# Altium schematic sheet supply.SchDoc
size A4
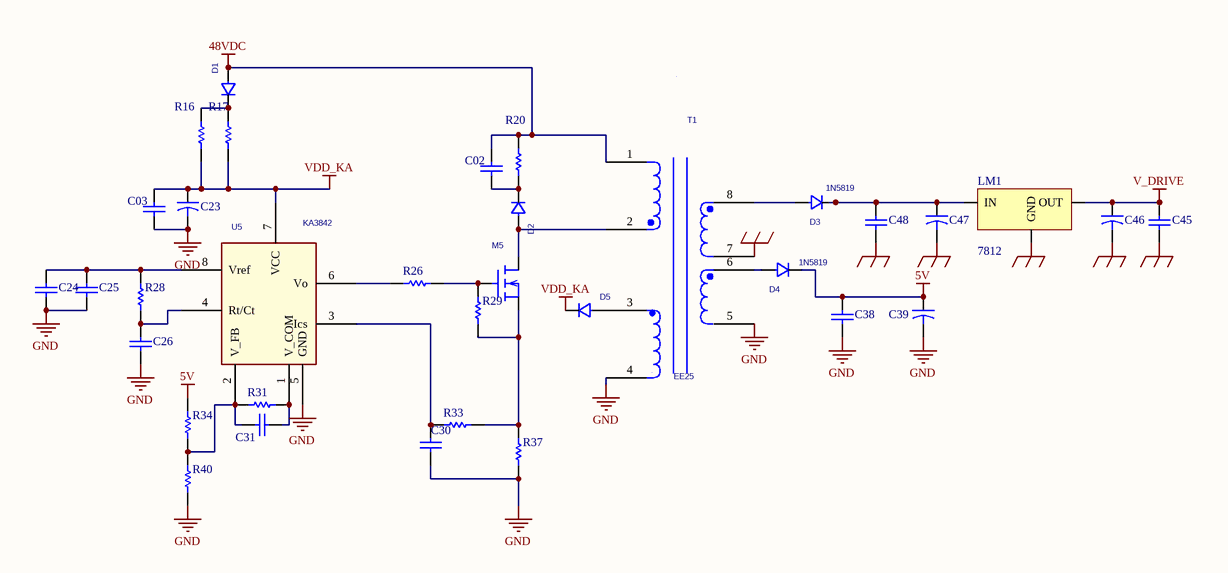
[diagram p0: supply.SchDoc]

## Parts
C02  CX4  [C0805]  (value not drawn)
C03  CX4  [C0805]  (value not drawn)
C23  CAP SMD1206  [CAP_10uF_SMD]  (value not drawn)
C24  CX4  [C0805]  (value not drawn)
C25  CX4  [C0805]  (value not drawn)
C26  CX4  [C0805]  (value not drawn)
C30  CX4  [C0805]  (value not drawn)
C31  CX4  [C0805]  (value not drawn)
C38  CX4  [C0805]  (value not drawn)
C39  CAP SMD1206  [Tu470]  (value not drawn)
C45  CX4  [C0805]  (value not drawn)
C46  CAP SMD1206  [Tu470]  (value not drawn)
C47  CAP SMD1206  [Tu470]  (value not drawn)
C48  CX4  [C0805]  (value not drawn)
D1  FR107  [DIODE5819_V1]  (value not drawn)
D2  FR107  [DIODE5819_V1]  (value not drawn)
D3  1N5819  [DIODE5819_V1]
D4  1N5819  [DIODE5819_V1]
D5  1N5819  [DIODE5819_V1]  (value not drawn)
LM1  7812  [TO220AB]
M5  IRF640  [TO220AB]  (value not drawn)
R16  Resistor SMD0805  [R0805]  (value not drawn)
R17  Resistor SMD0805  [R0805]  (value not drawn)
R20  Resistor SMD0805  [R0805]  (value not drawn)
R26  Resistor SMD0805  [R0805]  (value not drawn)
R28  Resistor SMD0805  [R0805]  (value not drawn)
R29  Resistor SMD0805  [R0805]  (value not drawn)
R31  Resistor SMD0805  [R0805]  (value not drawn)
R33  Resistor SMD0805  [R0805]  (value not drawn)
R34  Resistor SMD0805  [R0805]  (value not drawn)
R37  Resistor SMD0805  [R0805]  (value not drawn)
R40  Resistor SMD0805  [R0805]  (value not drawn)
T1  EE25  [TRANSFORMER]
U5  KA3842  [SOIC_8PIN]

## Nets
5V: C38.1 C39.1 D4.1 R34.2
48VDC: C02.1 D1.1 R20.1 T1.1
GND: C03.2 C23.2 C24.2 C25.2 C26.2 C30.1 C38.2 C39.2 R37.2 R40.1 T1.4 T1.5 U5.5(GND)
GND_EARTH: C45.2 C46.2 C47.2 C48.2 LM1.2(GND) T1.7
V_DRIVE: C45.1 C46.1 LM1.3(OUT)
VDD_KA: C03.1 C23.1 D5.1 R16.2 R17.2 U5.7(VCC)
NetC02_2: C02.2 D2.1 R20.2
NetC24_1: C24.1 C25.1 R28.2 U5.8(Vref)
NetC26_1: C26.1 R28.1 U5.4(Rt/Ct)
NetC30_2: C30.2 R33.1 U5.3(Ics)
NetC31_1: C31.1 R31.2 U5.1(V_COM)
NetC31_2: C31.2 R31.1 R34.1 R40.2 U5.2(V_FB)
NetC47_1: C47.1 C48.1 D3.1 LM1.1(IN)
NetD1_2: D1.2 R16.1 R17.1
NetD2_2: D2.2 M5.2(d) T1.2
NetD3_2: D3.2 T1.8
NetD4_2: D4.2 T1.6
NetD5_2: D5.2 T1.3
NetM5_1: M5.1(g) R26.1 R29.1
NetM5_3: M5.3(s) R29.2 R33.2 R37.1
NetR26_2: R26.2 U5.6(Vo)

## Library data of the parts
C02 C03 = Cap: Capacitor Type 0805 SMD; Value: 103-1kV; Published: 8-Jun-2000; LatestRevisionDate: 17-Jul-2002; LatestRevisionNote: Re-released for DXP Platform.; PackageReference: RAD-0.3; Publisher: Altium Limited
C23 = Cap2: Capacitor; Value: 47uF; Published: 23-Sep-2002; PackageReference: CAPR5-4X5; Publisher: Altium Limited
C24 = Cap: Capacitor Type 0805 SMD; Value: 1uF; Published: 8-Jun-2000; LatestRevisionDate: 17-Jul-2002; LatestRevisionNote: Re-released for DXP Platform.; PackageReference: RAD-0.3; Publisher: Altium Limited
C25 C38 C45 C48 = Cap: Capacitor Type 0805 SMD; Value: 100nF; Published: 8-Jun-2000; LatestRevisionDate: 17-Jul-2002; LatestRevisionNote: Re-released for DXP Platform.; PackageReference: RAD-0.3; Publisher: Altium Limited
C26 = Cap: Capacitor Type 0805 SMD; Value: 10nF; Published: 8-Jun-2000; LatestRevisionDate: 17-Jul-2002; LatestRevisionNote: Re-released for DXP Platform.; PackageReference: RAD-0.3; Publisher: Altium Limited
C30 C31 = Cap: Capacitor Type 0805 SMD; Value: 470pF; Published: 8-Jun-2000; LatestRevisionDate: 17-Jul-2002; LatestRevisionNote: Re-released for DXP Platform.; PackageReference: RAD-0.3; Publisher: Altium Limited
C39 C46 C47 = Cap2: Capacitor; Value: 470uF; Published: 23-Sep-2002; PackageReference: CAPR5-4X5; Publisher: Altium Limited
D1-D5 = 1N4148: PSpiceTemplate: D^@REFDES %1 %2 @MODEL ?AREA/@AREA/; COMPONENT: 1N4148
LM1 = Component_1
M5 = IRF540_Dup1: PSpiceTemplate: M^@REFDES %d %g %s %s @MODEL
R16 R17 = Res1: Value: 47K; Published: 8-Jun-2000; LatestRevisionDate: 17-Jul-2002; LatestRevisionNote: Re-released for DXP Platform.; PackageReference: AXIAL-0.3; Publisher: Altium Limited
R20 = Res1: Value: 22K; Published: 8-Jun-2000; LatestRevisionDate: 17-Jul-2002; LatestRevisionNote: Re-released for DXP Platform.; PackageReference: AXIAL-0.3; Publisher: Altium Limited
R26 = Res1: Value: 47; Published: 8-Jun-2000; LatestRevisionDate: 17-Jul-2002; LatestRevisionNote: Re-released for DXP Platform.; PackageReference: AXIAL-0.3; Publisher: Altium Limited
R28 = Res1: Value: 4k7; Published: 8-Jun-2000; LatestRevisionDate: 17-Jul-2002; LatestRevisionNote: Re-released for DXP Platform.; PackageReference: AXIAL-0.3; Publisher: Altium Limited
R29 R34 R40 = Res1: Value: 10k; Published: 8-Jun-2000; LatestRevisionDate: 17-Jul-2002; LatestRevisionNote: Re-released for DXP Platform.; PackageReference: AXIAL-0.3; Publisher: Altium Limited
R31 = Res1: Value: 100k; Published: 8-Jun-2000; LatestRevisionDate: 17-Jul-2002; LatestRevisionNote: Re-released for DXP Platform.; PackageReference: AXIAL-0.3; Publisher: Altium Limited
R33 = Res1: Value: 1k; Published: 8-Jun-2000; LatestRevisionDate: 17-Jul-2002; LatestRevisionNote: Re-released for DXP Platform.; PackageReference: AXIAL-0.3; Publisher: Altium Limited
R37 = Res1: Value: 1; Published: 8-Jun-2000; LatestRevisionDate: 17-Jul-2002; LatestRevisionNote: Re-released for DXP Platform.; PackageReference: AXIAL-0.3; Publisher: Altium Limited
T1 = TRAN_FBP1S4/SM_5
U5 = KA3842_1